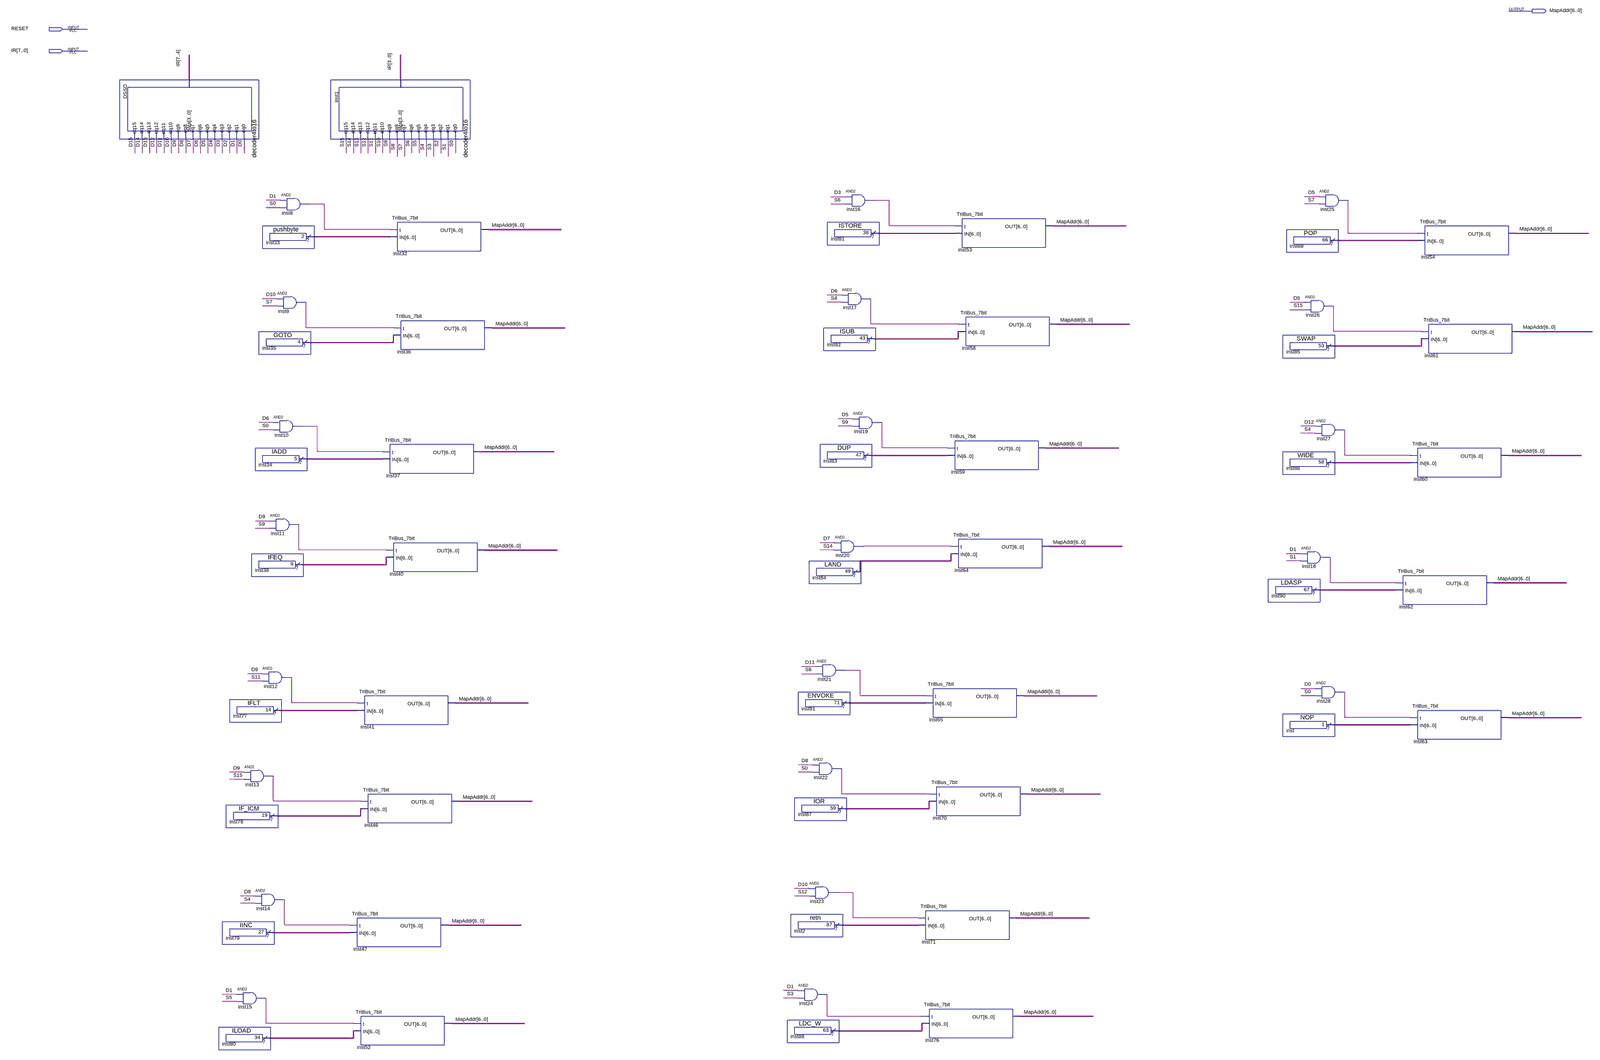
[diagram p0: schematic sheet, whole]
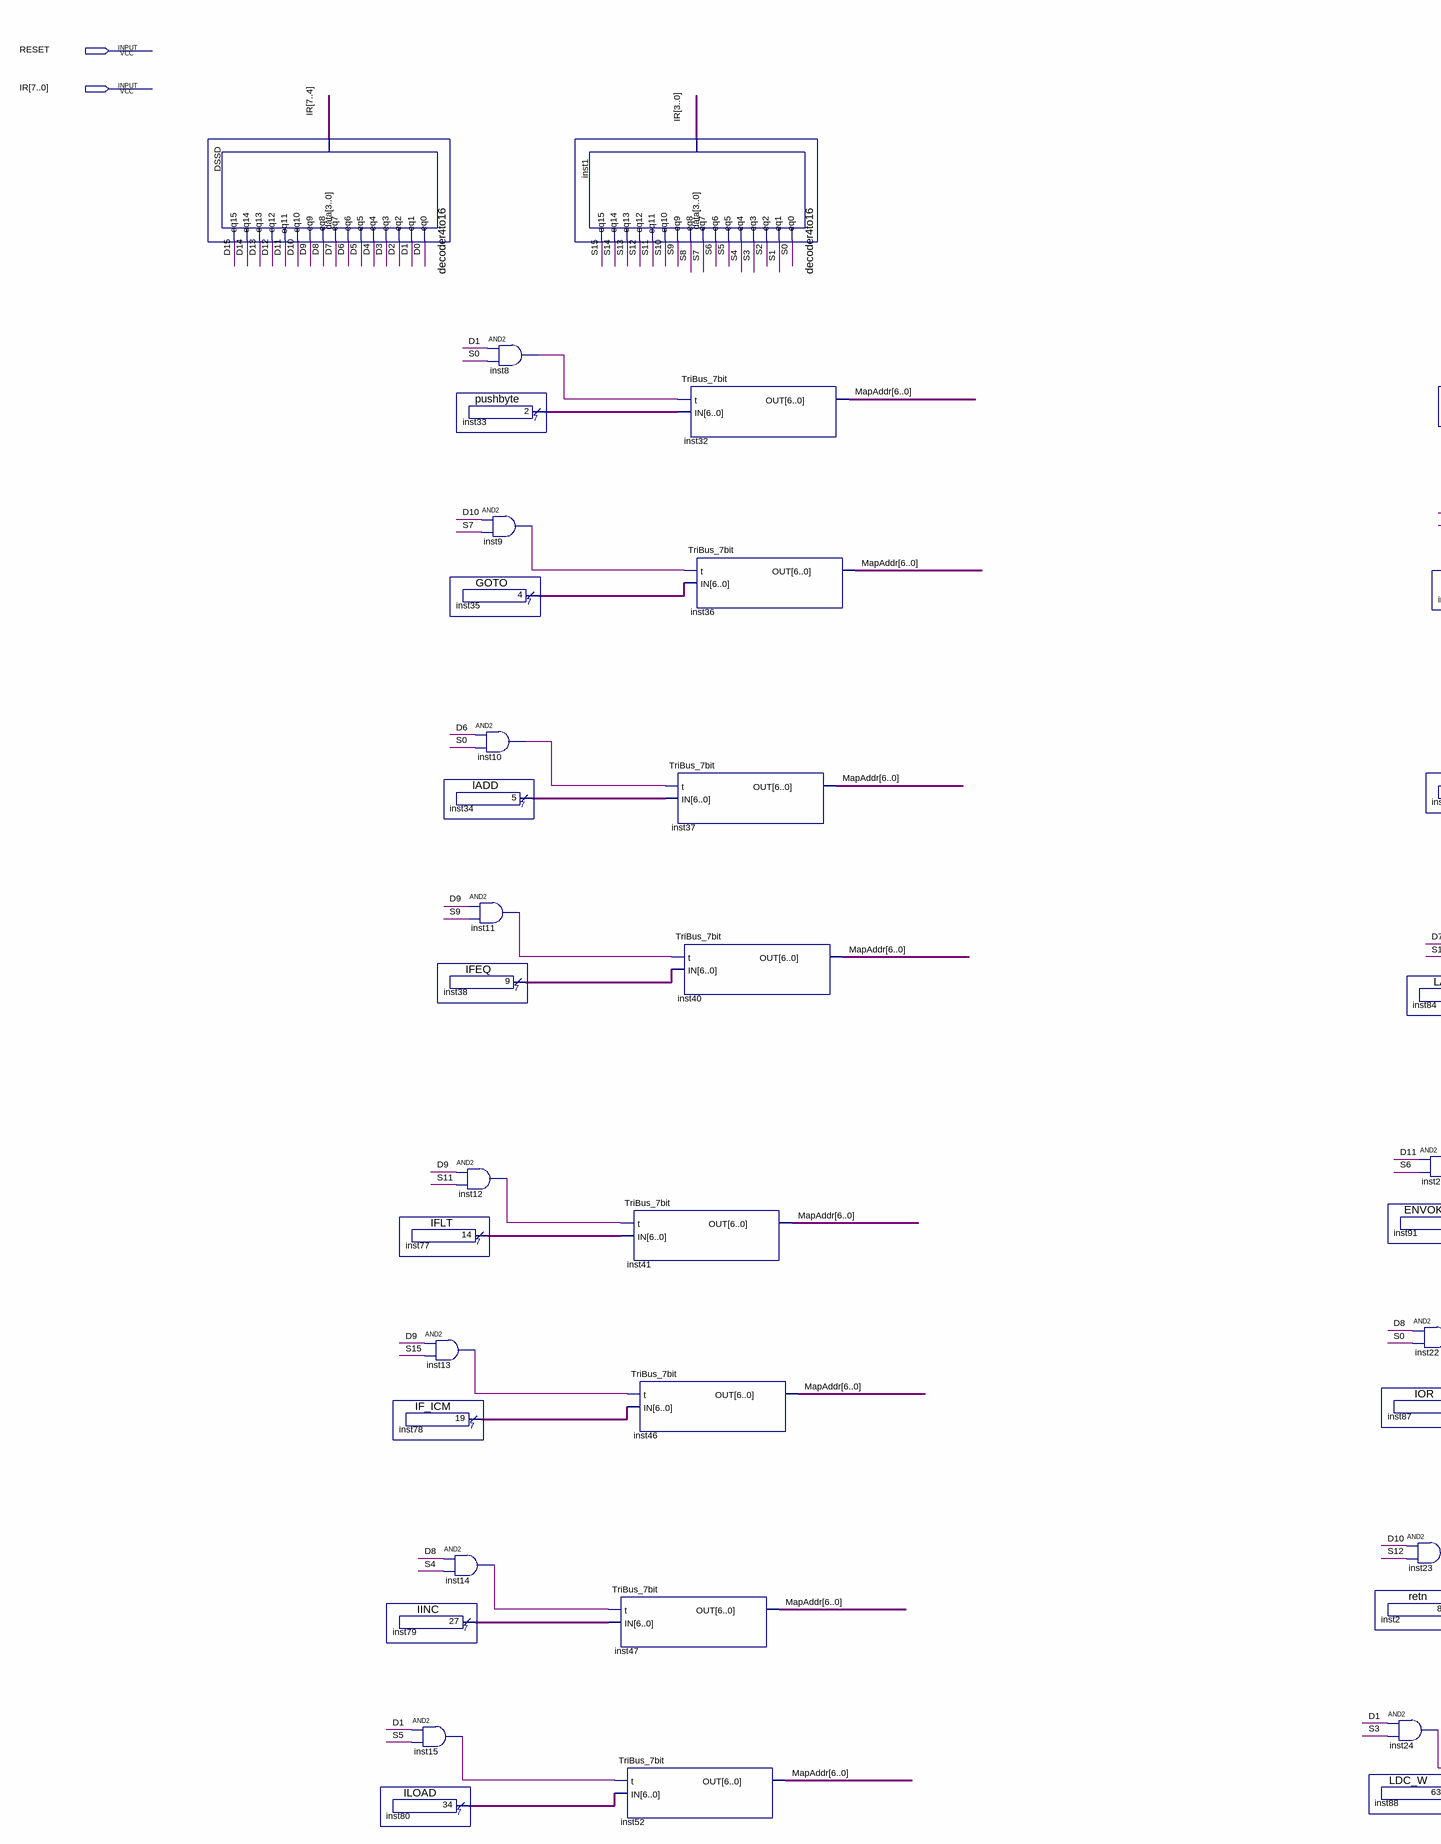
[diagram p1: schematic sheet, left part]
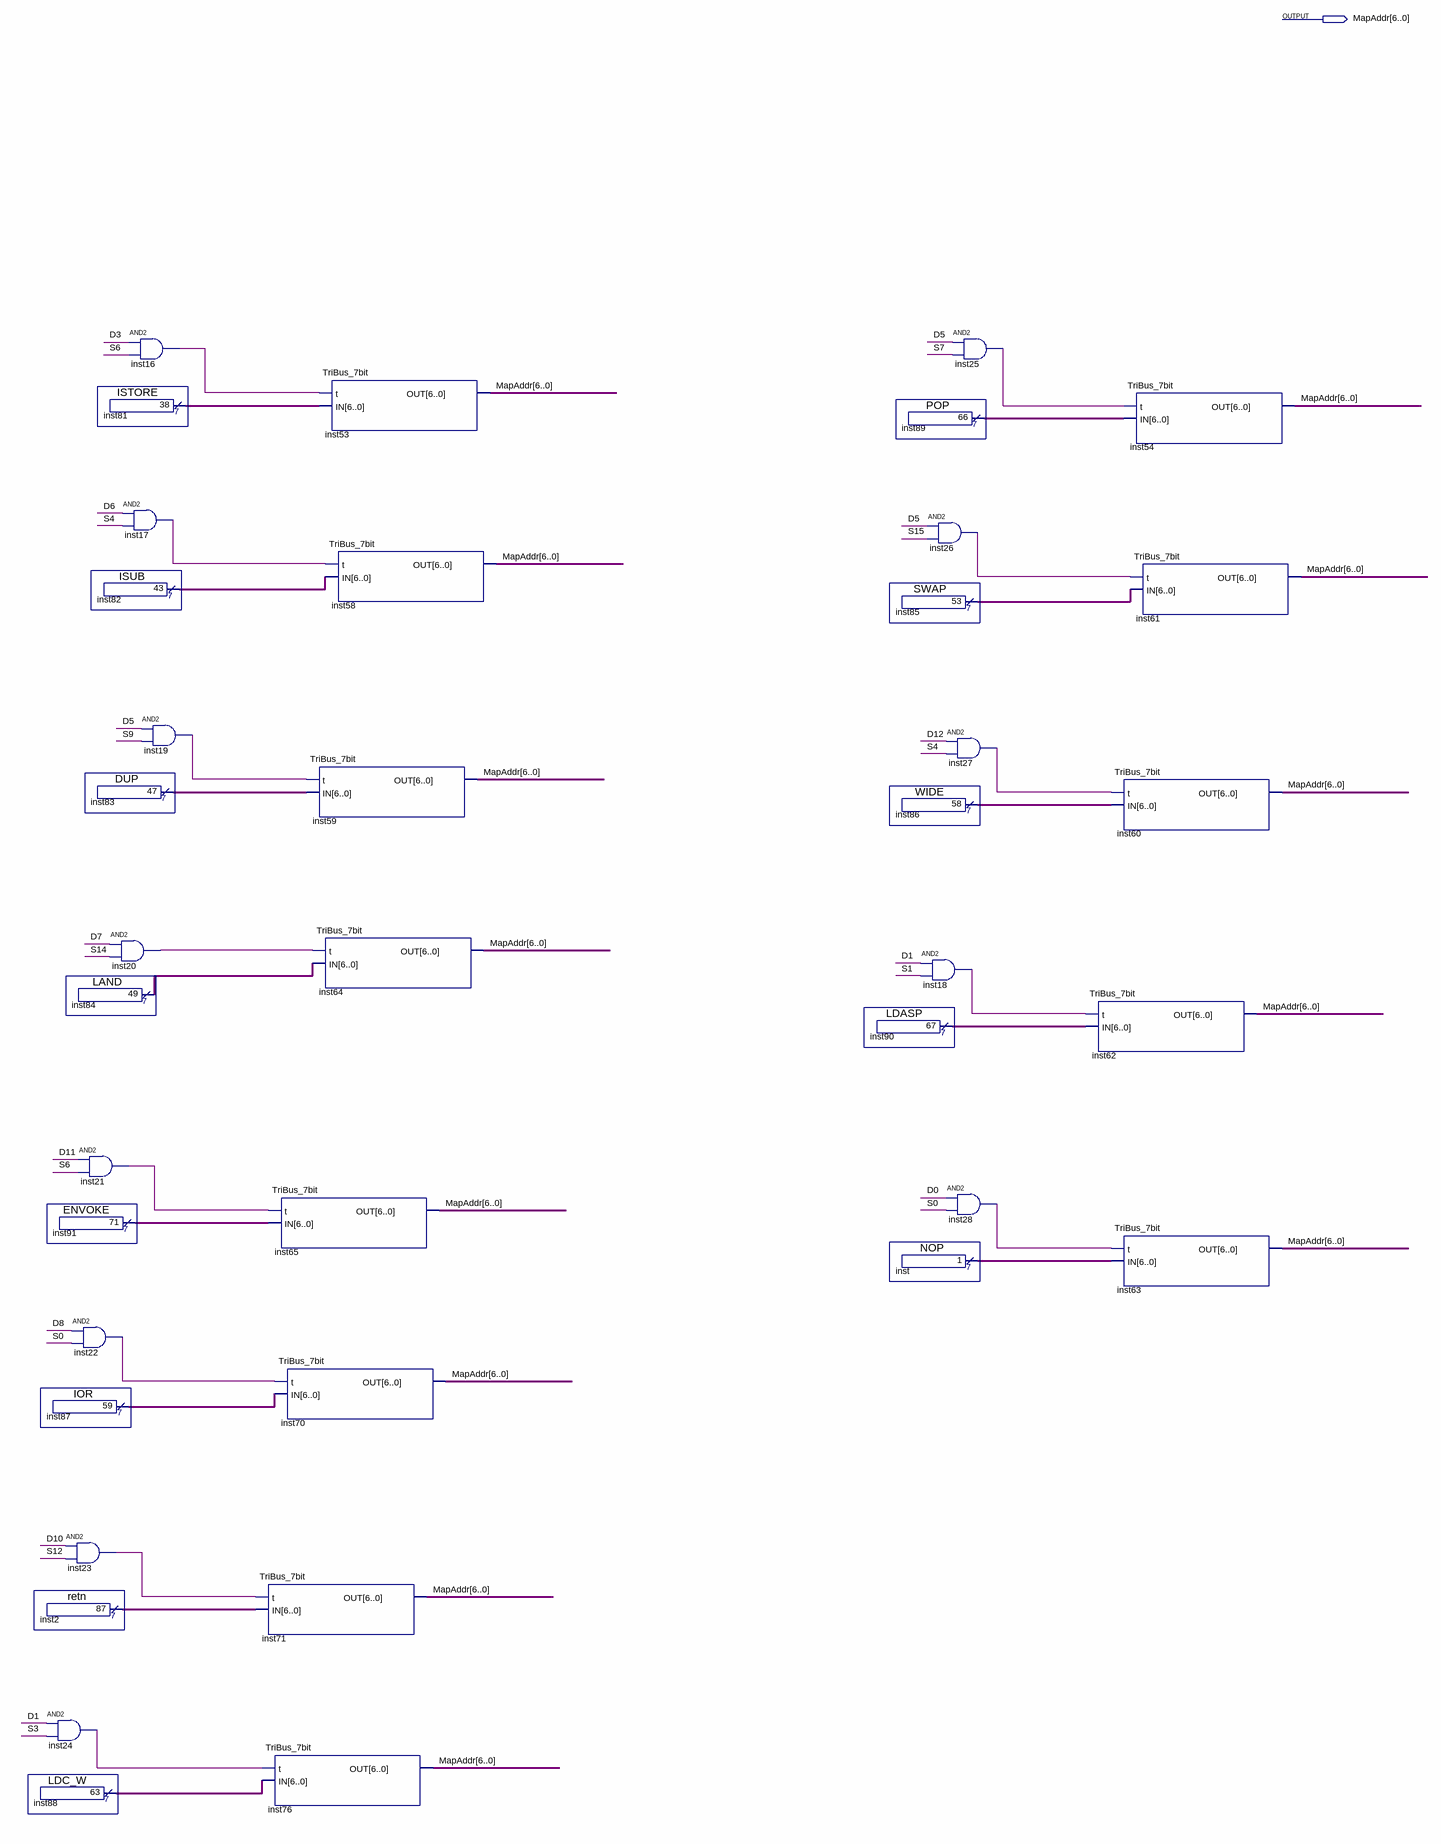
[diagram p2: schematic sheet, right part]
// Quartus schematic CU.bdf as structural Verilog: 65 symbols, 3 pins
module CU (
  input  RESET,
  input  [7:0] IR,
  output [6:0] MapAddr
);

  wire D0, D1, D2, D3, D4, D5, D6, D7, D8, D9, D10, D11, D12, D13, D14, D15, inst8_out, inst9_out,
       inst10_out, inst11_out, inst12_out, inst13_out, inst14_out, inst15_out, inst16_out, inst17_out,
       inst18_out, inst19_out, inst20_out, inst21_out, inst22_out, inst23_out, inst24_out, inst25_out,
       inst26_out, inst27_out, inst28_out, S0, S1, S2, S3, S4, S5, S6, S7, S8, S9, S10, S11, S12, S13, S14,
       S15;
  wire [6:0] inst2_result, inst33_result, inst34_result, inst35_result, inst38_result, inst77_result,
       inst78_result, inst79_result, inst80_result, inst81_result, inst82_result, inst83_result,
       inst84_result, inst85_result, inst86_result, inst87_result, inst88_result, inst89_result,
       inst90_result, inst91_result, inst_result;

  decoder4to16 DSSD (
    .data(IR[7:4]), .eq0(D0), .eq1(D1), .eq2(D2), .eq3(D3), .eq4(D4), .eq5(D5), .eq6(D6), .eq7(D7), .eq8(D8),
    .eq9(D9), .eq10(D10), .eq11(D11), .eq12(D12), .eq13(D13), .eq14(D14), .eq15(D15));
  IFLT inst77 (.result(inst77_result));
  IF_ICM inst78 (.result(inst78_result));
  IINC inst79 (.result(inst79_result));
  and inst15 (inst15_out, D1, S5);
  ILOAD inst80 (.result(inst80_result));
  pushbyte inst33 (.result(inst33_result));
  GOTO inst35 (.result(inst35_result));
  lADD inst34 (.result(inst34_result));
  IFEQ inst38 (.result(inst38_result));
  and inst12 (inst12_out, D9, S11);
  and inst13 (inst13_out, D9, S15);
  and inst14 (inst14_out, D8, S4);
  and inst8 (inst8_out, D1, S0);
  and inst9 (inst9_out, D10, S7);
  and inst10 (inst10_out, D6, S0);
  and inst11 (inst11_out, D9, S9);
  decoder4to16 inst1 (
    .data(IR[3:0]), .eq0(S0), .eq1(S1), .eq2(S2), .eq3(S3), .eq4(S4), .eq5(S5), .eq6(S6), .eq7(S7), .eq8(S8),
    .eq9(S9), .eq10(S10), .eq11(S11), .eq12(S12), .eq13(S13), .eq14(S14), .eq15(S15));
  TriBus_7bit inst47 (.t(inst14_out), .IN(inst79_result), .OUT(MapAddr));
  TriBus_7bit inst52 (.t(inst15_out), .IN(inst80_result), .OUT(MapAddr));
  TriBus_7bit inst37 (.t(inst10_out), .IN(inst34_result), .OUT(MapAddr));
  TriBus_7bit inst41 (.t(inst12_out), .IN(inst77_result), .OUT(MapAddr));
  TriBus_7bit inst46 (.t(inst13_out), .IN(inst78_result), .OUT(MapAddr));
  TriBus_7bit inst32 (.t(inst8_out), .IN(inst33_result), .OUT(MapAddr));
  TriBus_7bit inst36 (.t(inst9_out), .IN(inst35_result), .OUT(MapAddr));
  TriBus_7bit inst40 (.t(inst11_out), .IN(inst38_result), .OUT(MapAddr));
  retn inst2 (.result(inst2_result));
  LDC_W inst88 (.result(inst88_result));
  DUP inst83 (.result(inst83_result));
  LAND inst84 (.result(inst84_result));
  and inst21 (inst21_out, D11, S6);
  ENVOKE inst91 (.result(inst91_result));
  and inst22 (inst22_out, D8, S0);
  IOR inst87 (.result(inst87_result));
  and inst23 (inst23_out, D10, S12);
  and inst24 (inst24_out, D1, S3);
  and inst16 (inst16_out, D3, S6);
  ISTORE inst81 (.result(inst81_result));
  and inst17 (inst17_out, D6, S4);
  ISUB inst82 (.result(inst82_result));
  and inst20 (inst20_out, D7, S14);
  and inst19 (inst19_out, D5, S9);
  TriBus_7bit inst65 (.t(inst21_out), .IN(inst91_result), .OUT(MapAddr));
  TriBus_7bit inst70 (.t(inst22_out), .IN(inst87_result), .OUT(MapAddr));
  TriBus_7bit inst71 (.t(inst23_out), .IN(inst2_result), .OUT(MapAddr));
  TriBus_7bit inst76 (.t(inst24_out), .IN(inst88_result), .OUT(MapAddr));
  TriBus_7bit inst53 (.t(inst16_out), .IN(inst81_result), .OUT(MapAddr));
  TriBus_7bit inst58 (.t(inst17_out), .IN(inst82_result), .OUT(MapAddr));
  TriBus_7bit inst59 (.t(inst19_out), .IN(inst83_result), .OUT(MapAddr));
  TriBus_7bit inst64 (.t(inst20_out), .IN(inst84_result), .OUT(MapAddr));
  POP inst89 (.result(inst89_result));
  SWAP inst85 (.result(inst85_result));
  WIDE inst86 (.result(inst86_result));
  LDASP inst90 (.result(inst90_result));
  NOP inst (.result(inst_result));
  and inst26 (inst26_out, D5, S15);
  and inst27 (inst27_out, D12, S4);
  and inst18 (inst18_out, D1, S1);
  and inst28 (inst28_out, D0, S0);
  and inst25 (inst25_out, D5, S7);
  TriBus_7bit inst62 (.t(inst18_out), .IN(inst90_result), .OUT(MapAddr));
  TriBus_7bit inst54 (.t(inst25_out), .IN(inst89_result), .OUT(MapAddr));
  TriBus_7bit inst61 (.t(inst26_out), .IN(inst85_result), .OUT(MapAddr));
  TriBus_7bit inst60 (.t(inst27_out), .IN(inst86_result), .OUT(MapAddr));
  TriBus_7bit inst63 (.t(inst28_out), .IN(inst_result), .OUT(MapAddr));
endmodule
